# EAGLE design led-er-2xRJ46 (EAGLE 7.2.0)
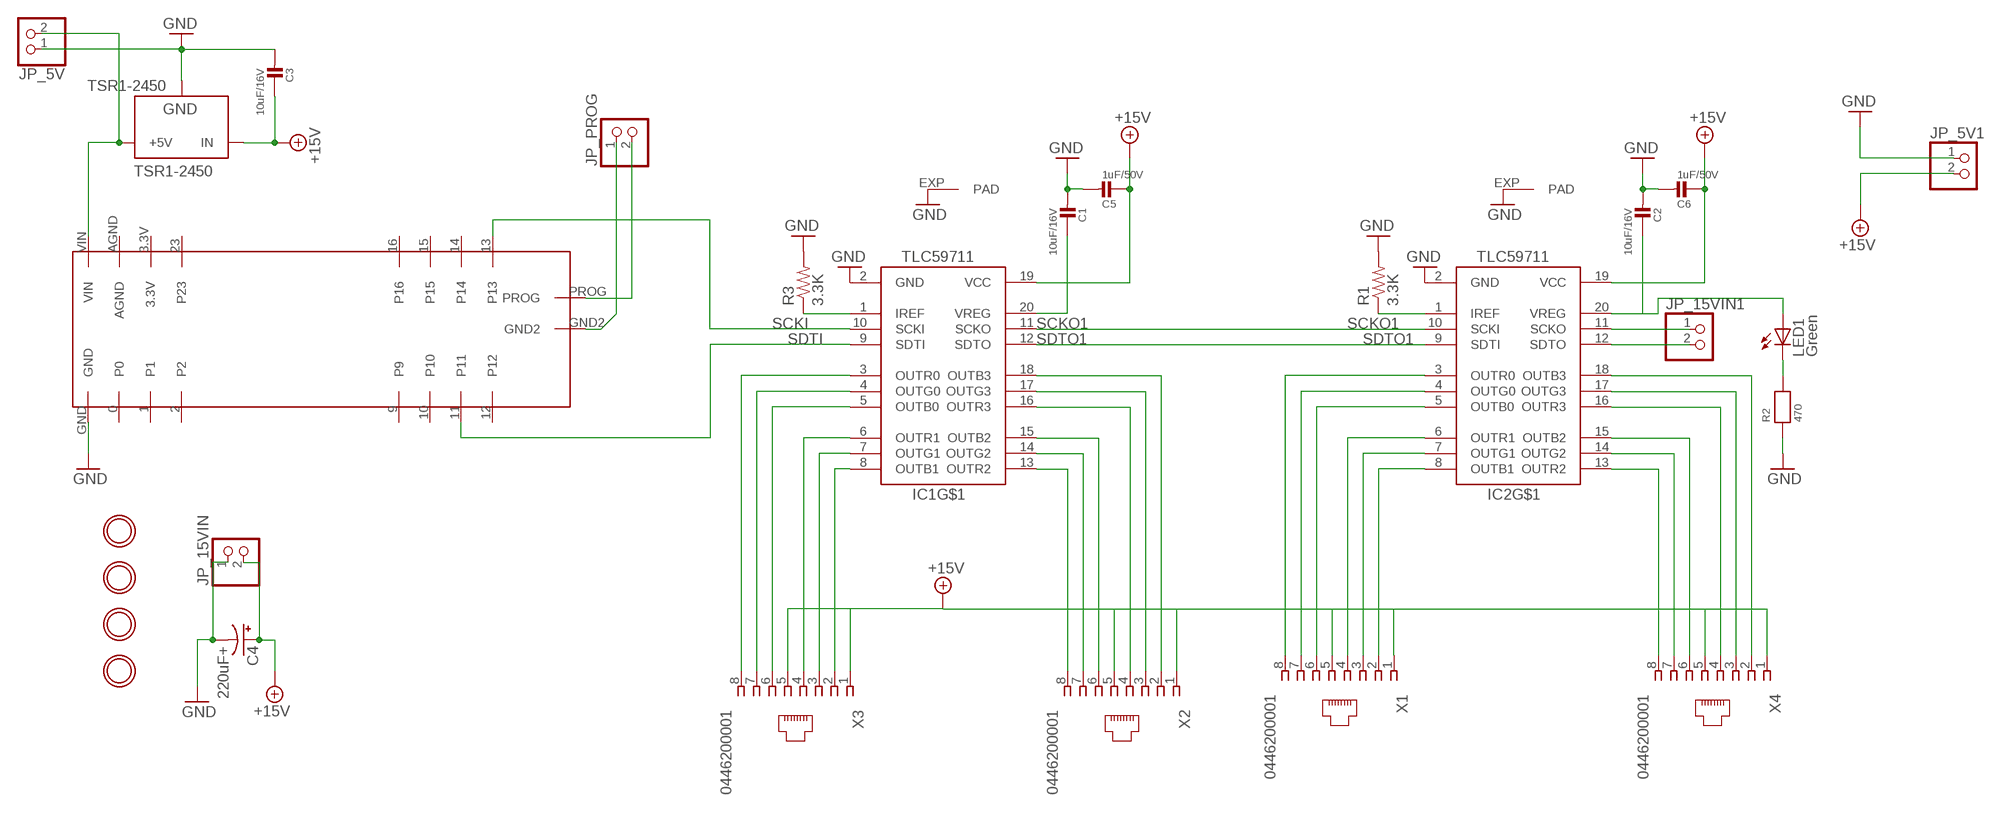
[diagram p0: schematic, sheet 1]

## Parts
C1  10uF/16V  CAP_CERAMIC0805  [0805]
C2  10uF/16V  CAP_CERAMIC0805  [0805]
C3  10uF/16V  CAP_CERAMIC0805  [0805]
C4  220uF+  CPOL-USE5-8.5  [E5-8,5]
C5  1uF/50V  CAP_CERAMIC0805  [0805]
C6  1uF/50V  CAP_CERAMIC0805  [0805]
IC1  TLC59711  [HTSSOP20DAP]
IC2  TLC59711  [HTSSOP20DAP]
JP_5V  HEADER-1X2  [1X02_OVAL]
JP_5V1  HEADER-1X2  [1X02_OVAL]
JP_15VIN  HEADER-1X2  [1X02_OVAL]
JP_15VIN1  HEADER-1X2  [1X02_OVAL]
JP_PROG  HEADER-1X2  [1X02_OVAL]
LED1  Green  LEDCHIP-LED0805  [CHIP-LED0805]
R1  3.3K  R-US_FLIPFLOP7  [0805-THM-7]
R2  470  RESISTOR0805  [0805]
R3  3.3K  R-US_FLIPFLOP7  [0805-THM-7]
TSR1-2450  TSR1-2450  [TSR-1]
U$1  MOUNTINGHOLE  [MOUNTINGHOLE_3.0_PLATED]
U$2  MOUNTINGHOLE  [MOUNTINGHOLE_3.0_PLATED]
U$3  MOUNTINGHOLE  [MOUNTINGHOLE_3.0_PLATED]
U$4  MOUNTINGHOLE  [MOUNTINGHOLE_3.0_PLATED]
U$5  TEENSY_LEDER  [TEENSY_LEDER]
X1  0446200001  [0446200001]
X2  0446200001  [0446200001]
X3  0446200001  [0446200001]
X4  0446200001  [0446200001]

## Nets
+15V: C3.1 C4.+ C5.1 C6.1 IC1.19(VCC) IC2.19(VCC) JP_5V1.2 JP_15VIN.2 TSR1-2450.1(IN) X1.1 X1.5 X2.1 X2.5 X3.1 X3.5 X4.1 X4.5
GND: C1.2 C2.2 C3.2 C4.- C5.2 C6.2 IC1.2(GND) IC1.EXP(PAD) IC2.2(GND) IC2.EXP(PAD) JP_5V1.1 JP_5V.1 JP_15VIN.1 R1.2 R2.1 R3.2 TSR1-2450.2(GND) U$5.GND
JP1: JP_5V.2 TSR1-2450.3(+5V) U$5.VIN
N$1: LED1.C R2.2
N$2: IC1.1(IREF) R3.1
N$3: IC1.16(OUTR3) X2.4
N$4: IC1.17(OUTG3) X2.3
N$5: IC1.18(OUTB3) X2.2
N$6: IC1.13(OUTR2) X2.8
N$7: IC1.14(OUTG2) X2.7
N$8: IC1.15(OUTB2) X2.6
N$9: IC1.3(OUTR0) X3.8
N$10: IC1.4(OUTG0) X3.7
N$11: IC1.5(OUTB0) X3.6
N$12: IC1.6(OUTR1) X3.4
N$13: IC1.7(OUTG1) X3.3
N$14: IC1.8(OUTB1) X3.2
N$15: IC2.1(IREF) R1.1
N$16: IC2.3(OUTR0) X1.8
N$17: IC2.4(OUTG0) X1.7
N$18: IC2.5(OUTB0) X1.6
N$19: IC2.6(OUTR1) X1.4
N$20: IC2.7(OUTG1) X1.3
N$21: IC2.8(OUTB1) X1.2
N$22: IC2.13(OUTR2) X4.8
N$23: IC2.14(OUTG2) X4.7
N$24: IC2.15(OUTB2) X4.6
N$25: IC2.16(OUTR3) X4.4
N$26: IC2.17(OUTG3) X4.3
N$27: IC2.18(OUTB3) X4.2
N$28: IC2.11(SCKO) JP_15VIN1.1
N$29: IC2.12(SDTO) JP_15VIN1.2
N$54: JP_PROG.1 U$5.GND2
N$55: JP_PROG.2 U$5.PROG
N$56: C1.1 IC1.20(VREG)
N$58: C2.1 IC2.20(VREG) LED1.A
SCKI: IC1.10(SCKI) U$5.13
SCKO1: IC1.11(SCKO) IC2.10(SCKI)
SDTI: IC1.9(SDTI) U$5.11
SDTO1: IC1.12(SDTO) IC2.9(SDTI)
Unconnected: U$5.0 U$5.1 U$5.2 U$5.3.3V U$5.9 U$5.10 U$5.12 U$5.14 U$5.15 U$5.16 U$5.23 U$5.AGND

## Library data of the parts
C1-C3 C5 C6 = microbuilder:CAP_CERAMIC: Ceramic Capacitors For new designs, use the packages preceded by an '_' character since they are more reliable: The following footprints should be used on most boards: _0402 - Standard footprint for regular board layouts _0603 - Standard footprint for regular board layouts _0805 - Standard footprint for regular board layouts For extremely tight-pitch boards where space is at a premium, the following 'micro-pitch' footprints can be used (smaller pads, no silkscreen outline, etc.): _0402MP - Micro-pitch footprint for very dense/compact boards _0603MP - Micro-pitch footprint for very dense/compact boards _0805MP - Micro-pitch footprint for very dense/compact boards Commonly Stocked Parts 0402 - 0402 Surface Mount Capacitors 16pF 50V 5% [Digikey: 445-4899-2-ND] 18pF 50V 5% [Digikey: 490-1281-2-ND] 22pF 50V 5% [Digikey: 490-1283-2-ND] 68pF 50V 5% [Digikey: 490-1289-2-ND] 0.1uF 10V 10% [Digikey: 490-1318-2-ND] 1.0uF 6.3V 10% [Digikey: 490-1320-2-ND] 0603 - 0603 Surface Mount Capacitors 16 pF 50V 5% [Digikey: 445-5051-2-ND] 22 pF 50V [Digikey: PCC220ACVTR-ND] 33 pF 50V 5% [Digikey: 490-1415-1-ND] 56pF 50V 5% [Digikey: 490-1421-1-ND] 220pF 50V 5% [Digikey: 445-1285-1-ND] 680 pF 50V 2200 pF 50V 5% C0G [Digikey: 445-1297-1-ND] 5600 pF 100V 5% X7R [Digikey: 478-3711-1-ND] 0.1 µF 25V 10% [Digikey: PCC2277TR-ND] 0.22 µF 16V 10% X7R [Digikey: 445-1318-1-ND] 1.0 µF 25V 10% [Digikey: 445-5146-2-ND] 0603 - RF Specific 3pF 250V +/-0.1pF RF [Digikey: 712-1347-1-ND] 18 pF 250V 5% [Digikey: 478-3505-1-ND or 712-1322-1-ND] 56 pF 250V 5% C0G RF [Digikey: 490-4867-1-ND] 68 pF 250V RF [Digikey: 490-4868-1-ND] 0805 - 0805 Surface Mount Capacitors 220 pF 250V 2% RF Ceramic Capacitor [Digikey: 712-1398-1-ND] 1000 pF 50V 2% NP0 Ceramic Capacitor [Digikey: 478-3760-1-ND] 0.1 µF 25V 10% Ceramic Capacitor [Digikey: PCC1828TR-ND] 1.0 µF 16V 10% Ceramic Capacitor[Digikey: 490-1691-2-ND] 10.0 µF 10V 10% Ceramic Capacitor[Digikey: 709-1228-1-ND] 10.0 uF 16V 10% Ceramic Capacitor [Digikey: 478-5165-2-ND] 47 uF 6.3V 20% Ceramic Capacitor [Digikey: 587-1779-1-ND or 399-5506-1-ND] 1206 - 1206 Surface Mount Capacitors 47uF 10V 20% Ceramic Capacitor [Digikey: 490-5528-1-ND or 399-5508-1-ND or 445-6010-1-ND] 100uF 6.3V -20%, +80% Y5V Ceramic Capacitor (Digikey: 490-4512-1-ND, Mouser: 81-GRM31CF50J107ZE1L)
C4 = adafruit:CPOL-US: POLARIZED CAPACITOR, American symbol
IC1 IC2 = adafruit:TLC59711
JP_5V JP_5V1 JP_15VIN JP_15VIN1 JP_PROG = microbuilder:HEADER-1X2: PIN HEADER
LED1 = adafruit:LED: LED OSRAM: - CHIPLED LG R971, LG N971, LY N971, LG Q971, LY Q971, LO R971, LY R971 LH N974, LH R974 LS Q976, LO Q976, LY Q976 LO Q996 - Hyper CHIPLED LW Q18S LB Q993, LB Q99A, LB R99A - SideLED LS A670, LO A670, LY A670, LG A670, LP A670 LB A673, LV A673, LT A673, LW A673 LH A674 LY A675 LS A676, LA A676, LO A676, LY A676, LW A676 LS A679, LY A679, LG A679 - Hyper Micro SIDELED® LS Y876, LA Y876, LO Y876, LY Y876 LT Y87S - SmartLED LW L88C, LW L88S LB L89C, LB L89S, LG L890 LS L89K, LO L89K, LY L89K LS L896, LA L896, LO L896, LY L896 - TOPLED LS T670, LO T670, LY T670, LG T670, LP T670 LSG T670, LSP T670, LSY T670, LOP T670, LYG T670 LG T671, LOG T671, LSG T671 LB T673, LV T673, LT T673, LW T673 LH T674 LS T676, LA T676, LO T676, LY T676, LB T676, LH T676, LSB T676, LW T676 LB T67C, LV T67C, LT T67C, LS T67K, LO T67K, LY T67K, LW E67C LS E67B, LA E67B, LO E67B, LY E67B, LB E67C, LV E67C, LT E67C LW T67C LS T679, LY T679, LG T679 LS T770, LO T770, LY T770, LG T770, LP T770 LB T773, LV T773, LT T773, LW T773 LH T774 LS E675, LA E675, LY E675, LS T675 LS T776, LA T776, LO T776, LY T776, LB T776 LHGB T686 LT T68C, LB T68C - Hyper Mini TOPLED® LB M676 - Mini TOPLED Santana® LG M470 LS M47K, LO M47K, LY M47K Source: http://www.osram.convergy.de/
R1 R3 = adafruit:R-US_: RESISTOR, American symbol
R2 = microbuilder:RESISTOR: Resistors For new designs, use the packages preceded by an '_' character since they are more reliable: The following footprints should be used on most boards: _0402 - Standard footprint for regular board layouts _0603 - Standard footprint for regular board layouts _0805 - Standard footprint for regular board layouts For extremely tight-pitch boards where space is at a premium, the following 'micro-pitch' footprints can be used (smaller pads, no silkscreen outline, etc.): _0402MP - Micro-pitch footprint for very dense/compact boards _0603MP - Micro-pitch footprint for very dense/compact boards _0805MP - Micro-pitch footprint for very dense/compact boards
TSR1-2450 = SteelCaveRobotics-Power:TSR1-2450: Traco Power TSR 1-2450 5.0v switching regulator
U$1-U$4 = microbuilder:MOUNTINGHOLE: Mounting Hole For #2 screws (0.086"/2.18mm width, 0.094"/2.4mm hole) use 2.5mm
U$5 = Andrews:TEENSY_LEDER
X1-X4 = con-molex:0446200001: RJ-45 INVERTED MODULAR JACK ASSEMBLY WITH RJ-11 KEEPOUT FEATURE Source: Data sheet <http://www.farnell.com/datasheets/73207.pdf>; OC_FARNELL: unknown

## Board
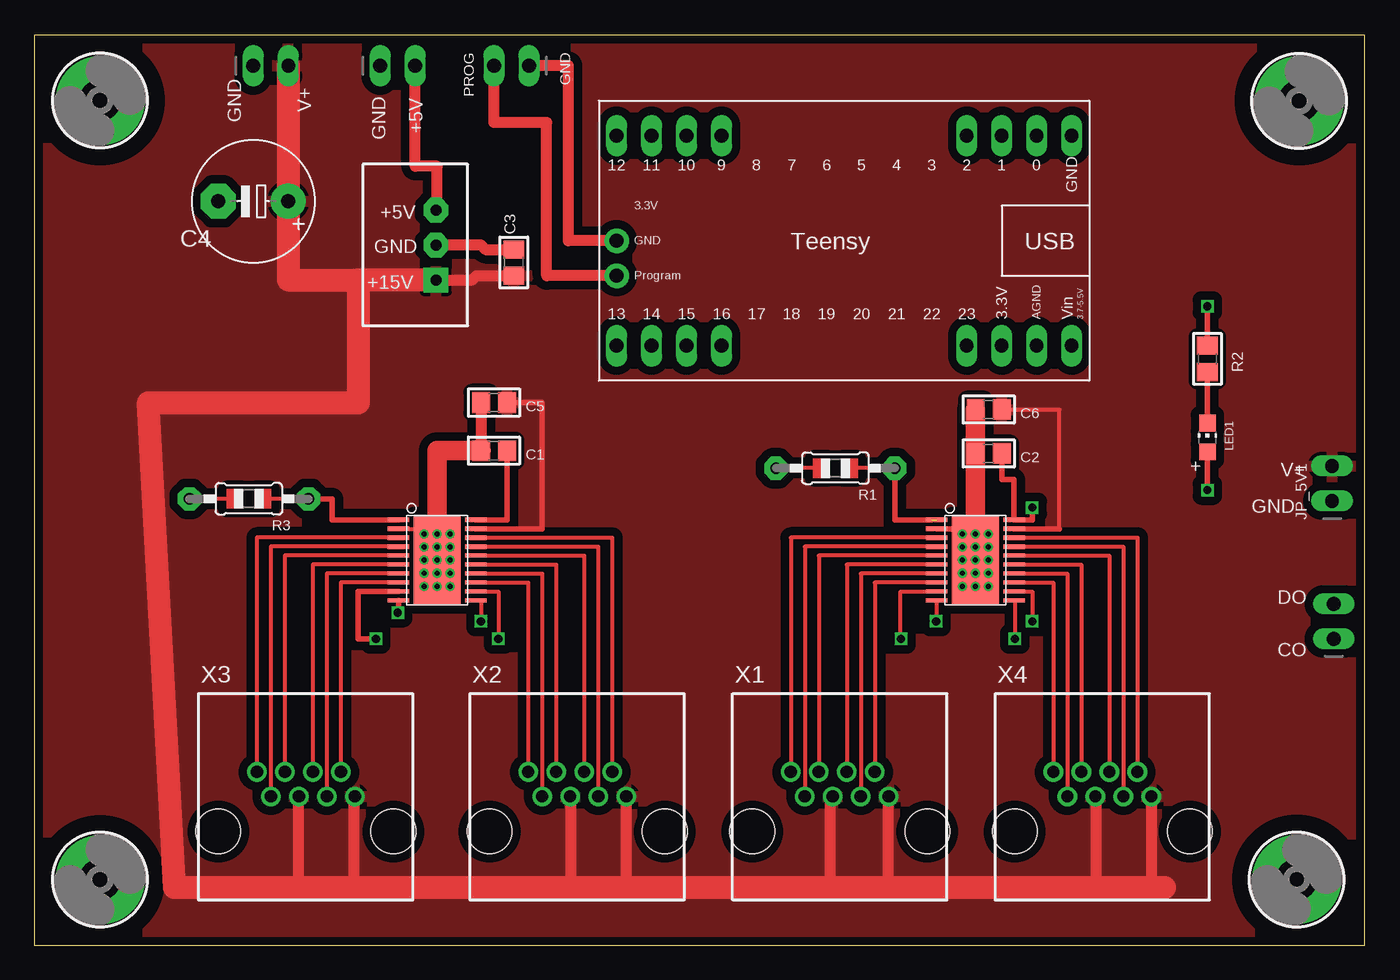
[diagram p1: board, top side]
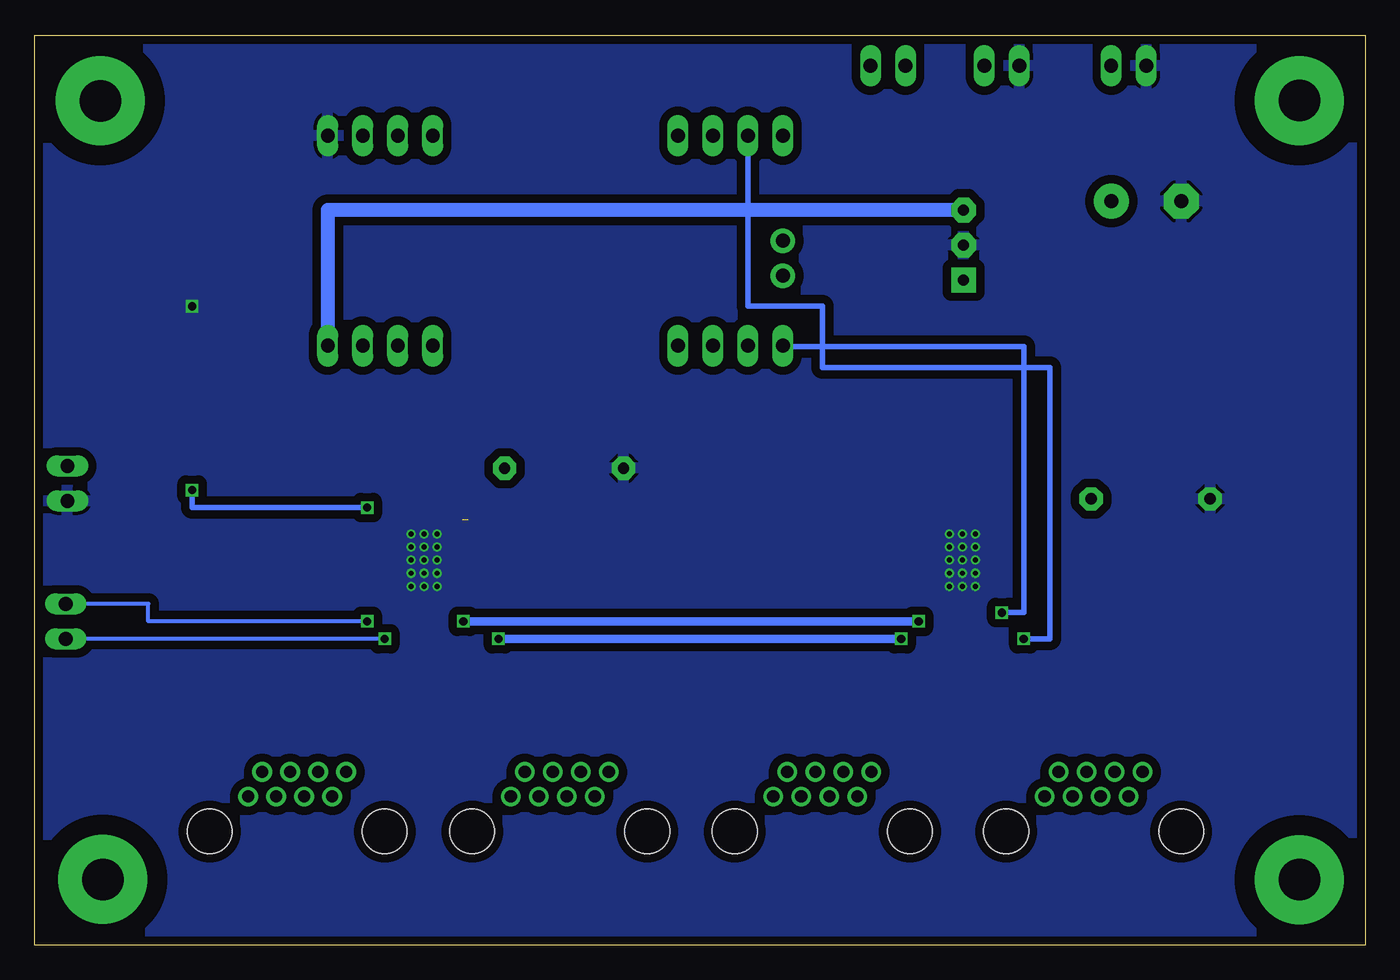
[diagram p2: board, bottom side, seen from below]

Size 96.51 x 66.03 mm. Coordinates in mm from the lower left corner, seen from the top.
Outline: 0,0 96.51,0 96.51,66.03 0,66.03 0,0
Copper layers (1*16): Top 0.035mm / dielectric 1.5mm / Bottom 0.035mm
Design rules "SeeedStudio_2layer_DRU_no_angle_20140221": minimum track width 6mil, minimum drill 12mil, track to track 6mil, track to pad 6mil, pad to pad 6mil, via to via 6mil, smd to smd 0mil, copper to edge 10mil, drill to drill 10mil, minimum pad ring 10mil, minimum via ring 6mil, stop-mask expansion 2mil, vias tented up to drill 100mil, thermal gap 10mil
tRestrict: area 27.3,25.2 to 27.9,26.3; area 18.8,11.5 to 19.4,12.2; area 38.6,11.5 to 39.2,12.2; area 57.6,11.5 to 58.2,12.2; area 76.5,11.5 to 77.3,12.2

### Footprints (pad centres in the part's own frame; a part is rotated, then mirrored left to right if it is on the bottom)
0805 = smd 1.3 x 1.5: 1 -0.95,0; 2 0.95,0
E5-8,5 = drill 1.016 pad 2.54: + -2.54,0 | drill 1.016 pad 2.54 octagon: - 2.54,0
HTSSOP20DAP = smd 0.3 x 1.55: 1 -2.925,-2.8; 2 -2.275,-2.8; 3 -1.625,-2.8; 4 -0.975,-2.8; 5 -0.325,-2.8; 6 0.325,-2.8; 7 0.975,-2.8; 8 1.625,-2.8; 9 2.275,-2.8; 10 2.925,-2.8; 11 2.925,2.8; 12 2.275,2.8; 13 1.625,2.8; 14 0.975,2.8; 15 0.325,2.8; 16 -0.325,2.8; 17 -0.975,2.8; 18 -1.625,2.8; 19 -2.275,2.8; 20 -2.925,2.8 | smd 6.5 x 3.4: EXP 0,0
1X02_OVAL = drill 1 long: 1 -1.27,0; 2 1.27,0
CHIP-LED0805 = smd 1.2 x 1.2: A 0,-1.05; C 0,1.05
0805-THM-7 = drill 0.813 pad 1.676 octagon: 1 -4.318,0; 2 4.318,0
TSR-1 = drill 0.8 pad 1.8 square: 1 -2.54,-1.5 | drill 0.8 pad 1.8 octagon: 2 0,-1.5; 3 2.54,-1.5
MOUNTINGHOLE_3.0_PLATED = drill 3 pad 6.452: P$1 0,0
TEENSY_LEDER = drill 1 pad 1.422 long: 0 12.7,7.62; 1 10.16,7.62; 2 7.62,7.62; 3.3V 10.16,-7.62; 9 -10.16,7.62; 10 -12.7,7.62; 11 -15.24,7.62; 12 -17.78,7.62; 13 -17.78,-7.62; 14 -15.24,-7.62; 15 -12.7,-7.62; 16 -10.16,-7.62; 23 7.62,-7.62; AGND 12.7,-7.62; GND 15.24,7.62; VIN 15.24,-7.62 | drill 1 pad 1.778: GND2 -17.78,0; PROG -17.78,-2.54
0446200001 = drill 0.889 pad 1.422: 1 3.556,2.54; 2 2.54,4.318; 3 1.524,2.54; 4 0.508,4.318; 5 -0.508,2.54; 6 -1.524,4.318; 7 -2.54,2.54; 8 -3.556,4.318 | hole 3.251: 6.35,0; -6.35,0

### Placement (x,y rotation side)
C1  33.34,35.88 180 top
C2  69.23,35.68 180 top
C3  34.78,49.53 90 top
C4  15.88,53.98 180 top
C5  33.34,39.37 180 top
C6  69.23,38.87 180 top
IC1  29.21,27.94 270 top
IC2  68.26,27.94 270 top
JP_5V  26.35,63.82 0 top
JP_5V1  94.14,33.5 90 top
JP_15VIN  17.14,63.82 0 top
JP_15VIN1  94.27,23.5 90 top
JP_PROG  34.61,63.82 180 top
LED1  85.09,36.84 0 top
R1  58.1,34.61 180 top
R2  85.09,42.55 270 top
R3  15.56,32.38 180 top
TSR1-2450  27.62,50.8 90 top
U$1  91.74,61.26 0 top
U$2  4.76,4.76 0 top
U$3  91.57,4.78 0 top
U$4  4.76,61.28 0 top
U$5  60.01,51.12 0 top
X1  58.42,8.25 0 top
X2  39.37,8.25 0 top
X3  19.68,8.25 0 top
X4  77.47,8.25 0 top

### Tracks (layer width: path | path; a pad name or v marks a point on that pad's centre or on a via)
+15V
  Top 0.305: 74.36,30.22 74.36,38.84 70.18,38.84 C6.1
  Top 0.406: IC1.19 36.83,30.22 36.83,39.37 C5.1 | IC2.19 74.36,30.22
  Top 0.813: 23.5,48.26 31.75,48.26 32.07,48.58 34.6,48.58 C3.1 | X3.5 19.12,10.8 19.12,4.18 | X3.1 23.17,10.8 23.17,4.18 | X2.5 38.88,10.8 38.88,4.18 | X2.1 42.93,4.18 | X1.5 57.71,10.8 57.71,4.18 | X4.5 77,10.8 77,4.18 | X4.1 81.04,10.8 81.04,4.18 | X1.1 61.91,10.8 61.91,4.18
  Top 1.676: JP_15VIN.2 C4.+ 18.41,48.26 23.5,48.26 | TSR1-2450.1 23.5,48.26 | 23.5,48.26 23.5,39.37 8.26,39.37 10.16,4.18 19.12,4.18 23.17,4.18 38.88,4.18 42.93,4.18 57.71,4.18 61.91,4.18 77,4.18 81.04,4.18 81.99,4.18
  pour Top (isolate 0.61): 0,66.04 0,0 96.52,0 96.52,66.04
GND  (via drill 0.36, 0.6)
  Top 0.305: 66.94,30.22 v67.31,29.84 | IC1.2 28.26,30.22 v28.26,29.84
  Top 0.406: IC2.2 66.94,30.22 | R2.1 v85.09,46.36
  Top 0.813: C3.2 34.6,50.48 32.7,50.48 32.38,50.8 TSR1-2450.2 | C5.2 C1.2
  Top 1.422: C1.2 29.21,35.88 v29.21,29.84 | C6.2 C2.2 68.26,33.78 v68.26,29.84
  other vias: 68.26,27.94 69.22,27.94 67.31,27.94 67.31,26.99 68.26,26.99 69.22,26.99 69.22,28.89 68.26,28.89 67.31,28.89 67.31,26.04 68.26,26.04 69.22,26.04 29.21,27.94 28.26,27.94 30.16,27.94 30.16,28.89 29.21,28.89 28.26,28.89 30.16,29.84 30.16,26.99 29.21,26.99 28.26,26.99 28.26,26.04 29.21,26.04 30.16,26.04 69.22,29.84
  pour Bottom (isolate 0.61, rank 2): 0,66.04 0,0 96.52,0 96.52,66.04
JP1
  Top 0.61: TSR1-2450.3 29.21,53.34
  Top 0.813: 29.21,53.34 29.21,56.52 27.62,56.52 JP_5V.2
  Bottom 1.016: TSR1-2450.3 75.25,53.34 U$5.VIN
N$1
  Top 0.406: R2.2 LED1.C
N$2
  Top 0.406: IC1.1 21.59,30.87 21.59,32.38 R3.1
N$3
  Top 0.305: IC1.16 39.88,28.27 X2.4
N$4
  Top 0.305: IC1.17 40.89,28.91 X2.3
N$5
  Top 0.305: IC1.18 41.91,29.56 X2.2
N$6
  Top 0.305: IC1.13 35.81,26.32 X2.8
N$7
  Top 0.305: IC1.14 36.83,26.96 X2.7
N$8
  Top 0.305: IC1.15 37.85,27.62 X2.6
N$9
  Top 0.305: IC1.3 16.13,29.56 X3.8
N$10
  Top 0.305: IC1.4 17.14,28.91 X3.7
N$11
  Top 0.305: IC1.5 18.16,28.27 X3.6
N$12
  Top 0.305: IC1.6 20.19,27.62 X3.4
N$13
  Top 0.305: IC1.7 21.21,26.96 X3.3
N$14
  Top 0.305: IC1.8 22.23,26.32 X3.2
N$15  (1 unrouted)
  Top 0.406: 65.09,30.87 62.42,30.87 R1.1
N$16
  Top 0.305: IC2.3 54.86,29.56 X1.8
N$17
  Top 0.305: IC2.4 55.88,28.91 X1.7
N$18
  Top 0.305: IC2.5 56.9,28.27 X1.6
N$19
  Top 0.305: IC2.6 58.93,27.62 X1.4
N$20
  Top 0.305: IC2.7 59.94,26.96 X1.3
N$21
  Top 0.305: IC2.8 60.96,26.32 X1.2
N$22
  Top 0.305: IC2.13 73.91,26.32 X4.8
N$23
  Top 0.305: IC2.14 74.93,26.96 X4.7
N$24
  Top 0.305: IC2.15 75.95,27.62 X4.6
N$25
  Top 0.305: IC2.16 77.98,28.27 X4.4
N$26
  Top 0.305: IC2.17 78.99,28.91 X4.3
N$27
  Top 0.305: IC2.18 80.01,29.56 X4.2
N$28  (via drill 0.6)
  Top 0.305: IC2.11 71.12,25.02 v71.12,22.23
  Bottom 0.305: v71.12,22.23 JP_15VIN1.1
N$29  (via drill 0.6)
  Top 0.305: IC2.12 72.39,25.66 v72.39,23.5
  Bottom 0.305: v72.39,23.5 88.27,23.5 88.27,24.77 JP_15VIN1.2
N$54
  Top 0.813: U$5.GND2 38.73,51.12 38.73,63.82 JP_PROG.1
N$55
  Top 0.813: U$5.PROG 37.15,48.58 37.15,59.69 33.34,59.69 JP_PROG.2
N$56
  Top 0.406: IC1.20 34.29,30.87 C1.1
N$58  (via drill 0.6)
  Top 0.406: v72.39,31.75 72.39,30.87 IC2.20 71.06,33.78 70.18,33.78 C2.1 | v85.09,33.02 LED1.A
  Bottom 0.406: v72.39,31.75 85.09,31.75 v85.09,33.02
SCKI  (via drill 0.6)
  Top 0.406: v26.35,24.13 26.41,24.13 IC1.10
  Bottom 0.406: v26.35,24.13 24.74,24.13 24.74,43.42 42.23,43.42 U$5.13
SCKO1  (via drill 0.6)
  Top 0.305: 65.09,25.02 IC2.10 65.46,23.5 v65.41,23.5 | IC1.11 32.38,25.02 v32.38,23.5
  Bottom 0.61: v32.38,23.5 v65.41,23.5
SDTI  (via drill 0.6)
  Top 0.406: IC1.9 23.5,25.66 23.5,22.23 v24.77,22.23
  Bottom 0.406: v24.77,22.23 22.86,22.23 22.86,41.91 39.37,41.91 39.37,46.36 44.77,46.36 U$5.11
SDTO1  (via drill 0.6)
  Top 0.305: IC1.12 33.66,25.66 v33.66,22.23 | v62.87,22.23 62.84,22.23 62.84,25.65 65.46,25.65 IC2.9
  Bottom 0.61: v33.66,22.23 v62.87,22.23

### Text on the board
tPlace: PROG | GND | GND | V+ | GND | +5V | +5V | GND | +15V | V+ | GND | DO | CO